# EAGLE design TriggerTrap MainBoard 0v39 Release (EAGLE 6.2)
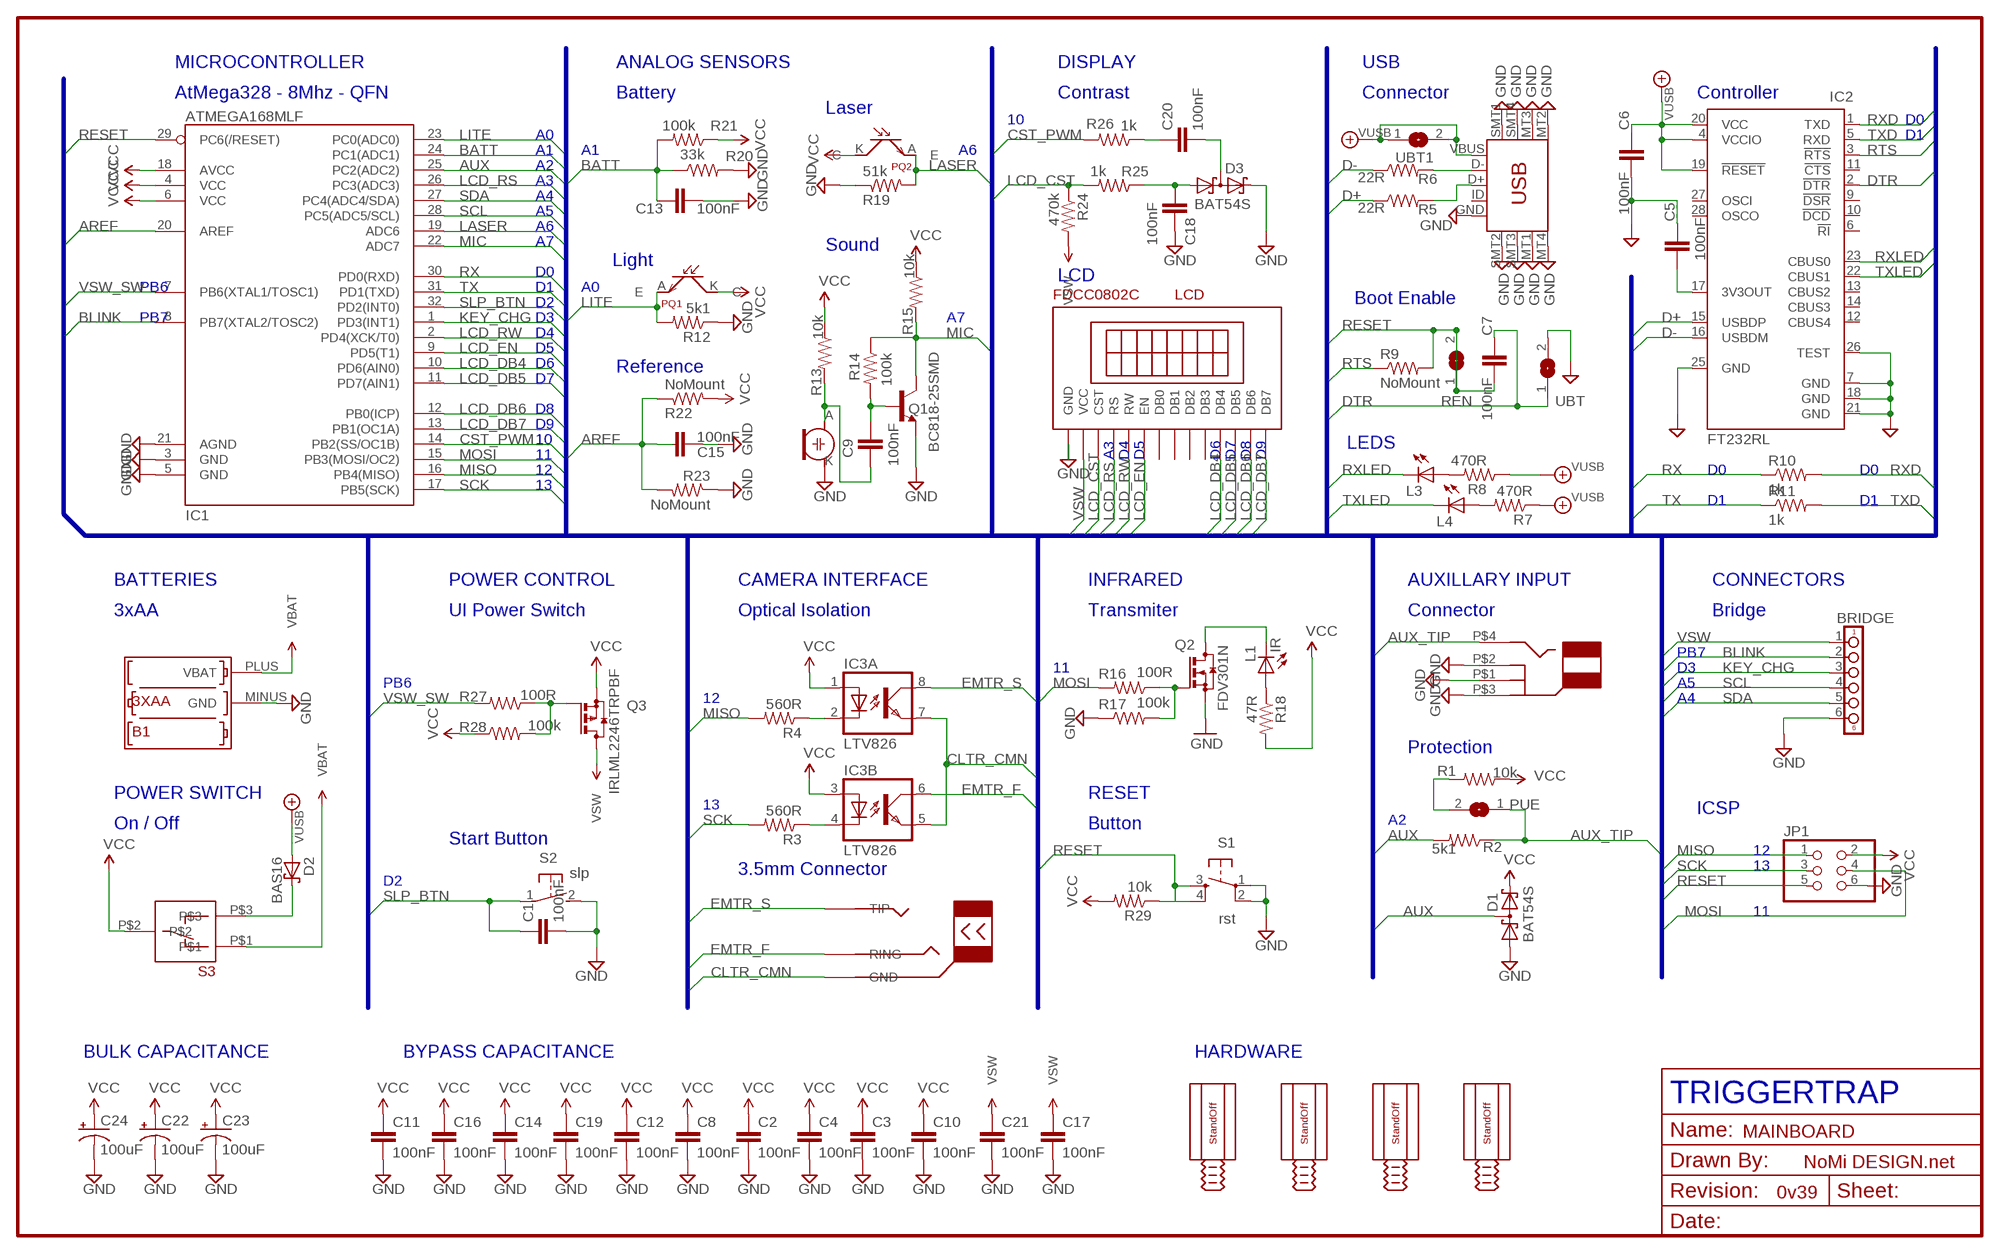
[diagram p0: schematic, sheet 1]

## Parts
AUXJACK  CUI_RCJ-017-RCA  [RCA_CUI_RCJ-017]
B1  3XAA  [3XAA-CASE]
BRIDGE  PINHD-1X6  [1X06]
C1  100nF  CAP0603-CAP  [0603-CAP]
C2  100nF  CAP0603-CAP  [0603-CAP]
C3  100nF  CAP0603-CAP  [0603-CAP]
C4  100nF  CAP0603-CAP  [0603-CAP]
C5  100nF  CAP0603-CAP  [0603-CAP]
C6  100nF  CAP0603-CAP  [0603-CAP]
C7  100nF  CAP0603-CAP  [0603-CAP]
C8  100nF  CAP0603-CAP  [0603-CAP]
C9  100nF  CAP0603-CAP  [0603-CAP]
C10  100nF  CAP0603-CAP  [0603-CAP]
C11  100nF  CAP0603-CAP  [0603-CAP]
C12  100nF  CAP0603-CAP  [0603-CAP]
C13  100nF  CAP0603-CAP  [0603-CAP]
C14  100nF  CAP0603-CAP  [0603-CAP]
C15  100nF  CAP0603-CAP  [0603-CAP]
C16  100nF  CAP0603-CAP  [0603-CAP]
C17  100nF  CAP0603-CAP  [0603-CAP]
C18  100nF  CAP0603-CAP  [0603-CAP]
C19  100nF  CAP0603-CAP  [0603-CAP]
C20  100nF  CAP0603-CAP  [0603-CAP]
C21  100nF  CAP0603-CAP  [0603-CAP]
C22  100uF  CPOL-USE2.5-7  [E2,5-7]
C23  100uF  CPOL-USE2.5-7  [E2,5-7]
C24  100uF  CPOL-USE2.5-7  [E2,5-7]
CAMJACK  AUDIO_3.5MM_L_3523  [AUDIO_3.5MM_LONG]
D1  BAT54S  [SOT23]
D2  BAS16  BAS40  [SOT23]
D3  BAT54S  [SOT23]
IC1  ATMEGA168MLF  [MLF32]
IC2  FT232RL  [SSOP28]
IC3  LTV826  [DIL08R]
JP1  PINHD-2X3/90  [2X03/90]
L1  IR  LEDSIDE_LED  [SIDE_LED]
L3  LEDCHIPLED_0805  [CHIPLED_0805]
L4  LEDCHIPLED_0805  [CHIPLED_0805]
LCD  FDCC0802C  [8X2-TOPLCD]
M1  254-ECM94-RO  MIC  [MIC-254-ECM94-RO]
PQ1  TEPT4400  AMB-LIGHT-SENS  [LED-3MM]
PQ2  EL-PT204-6C  LASER_SNS3MM  [LSR-SNS-3MM]
PUE  SJ  [SJ]
Q1  BC818-25SMD  [SOT23-BEC]
Q2  FDV301N  BSS123  [SOT23]
Q3  IRLML2246TRPBF  BSS84  [SOT23]
R1  10k  RESISTOR0603-RES  [0603-RES]
R2  5k1  RESISTOR0603-RES  [0603-RES]
R3  560R  RESISTOR0603-RES  [0603-RES]
R4  560R  RESISTOR0603-RES  [0603-RES]
R5  22R  R-US_R0603  [R0603]
R6  22R  R-US_R0603  [R0603]
R7  470R  R-US_R0603  [R0603]
R8  470R  R-US_R0603  [R0603]
R9  NoMount  R-US_R0603  [R0603]
R10  1k  R-US_R0603  [R0603]
R11  1k  R-US_R0603  [R0603]
R12  5k1  RESISTOR0603-RES  [0603-RES]
R13  10k  R-US_R0603  [R0603]
R14  100k  R-US_R0603  [R0603]
R15  10k  R-US_R0603  [R0603]
R16  100R  R-US_R0603  [R0603]
R17  100k  R-US_R0603  [R0603]
R18  47R  RESISTOR0603-RES  [0603-RES]
R19  51k  RESISTOR0603-RES  [0603-RES]
R20  33k  R-US_R0603  [R0603]
R21  100k  R-US_R0603  [R0603]
R22  NoMount  R-US_R0603  [R0603]
R23  NoMount  R-US_R0603  [R0603]
R24  470k  R-US_R0603  [R0603]
R25  1k  R-US_R0603  [R0603]
R26  1k  R-US_R0603  [R0603]
R27  100R  R-US_R0603  [R0603]
R28  100k  R-US_R0603  [R0603]
R29  10k  RESISTOR0603-RES  [0603-RES]
REN  SJ  [SJ]
S1  rst  TAC_SWITCHSMD  [TACTILE_SWITCH_SMD]
S2  slp  31-XX  [B3F-31XX]
S3  OS102011MA1QN1  SLIDESWITCH  [OS102011MA1QN1]
U$2  STAND-0FF-3.2  [STAND-OFF]
U$23  STAND-0FF-3.2  [STAND-OFF]
U$24  STAND-0FF-3.2  [STAND-OFF]
U$25  STAND-0FF-3.2  [STAND-OFF]
UBT  SJ  [SJ]
UBT1  SJ  [SJ]
USB  USB-MICRO-B-SMD  [USB-MICROB-SMD]

## Nets
AREF: C15.1 IC1.20(AREF) R22.1 R23.2
AUX: D1.3(C1A2) IC1.25(PC2(ADC2)) R2.2
AUX_TIP: AUXJACK.P$4(TIP) PUE.1 R2.1
BATT: C13.1 IC1.24(PC1(ADC1)) R20.1 R21.2
BLINK: BRIDGE.2 IC1.8(PB7(XTAL2/TOSC2))
CLTR_CMN: CAMJACK.P$1(GND) IC3.5(B:EMIT) IC3.7(A:EMIT)
CST_PWM: IC1.14(PB2(SS/OC1B)) R26.2
D+: IC2.15(USBDP) R5.1
D-: IC2.16(USBDM) R6.1
DTR: C7.1 IC2.2(!DTR) UBT.1
EMTR_F: CAMJACK.P$3(RING) IC3.6(B:COL)
EMTR_S: CAMJACK.P$2(TIP) IC3.8(A:COL)
GND: AUXJACK.P$1(GND1) AUXJACK.P$2(GND2) AUXJACK.P$3(GND) B1.MINUS(GND) BRIDGE.6 C1.2 C2.2 C3.2 C4.2 C5.1 C6.2 C8.2 C10.2 C11.2 C12.2 C13.2 C14.2 C15.2 C16.2 C17.2 C18.1 C19.2 C21.2 C22.- C23.- C24.- D1.1(A1) D3.2(C2) IC1.3(GND) IC1.5(GND) IC1.21(AGND) IC2.7(GND) IC2.18(GND) IC2.21(GND) IC2.25(GND) IC2.26(TEST) JP1.6 LCD.P$1(GND) M1.K Q1.E Q2.2(S) R12.1 R17.1 R19.1 R20.2 R23.1 S1.1 S1.2 S2.2(S) UBT.2 USB.GND USB.MT1(MTN1) USB.MT2(MTN2) USB.MT3(MTN3) USB.MT4(MTN4) USB.SMT1 USB.SMT2 USB.SMT3 USB.SMT4
KEY_CHG: BRIDGE.3 IC1.1(PD3(INT1))
LASER: IC1.19(ADC6) PQ2.A(E) R19.2
LCD_CST: LCD.P$3(CST) R24.1 R25.2
LCD_DB4: IC1.10(PD6(AIN0)) LCD.P$11(DB4)
LCD_DB5: IC1.11(PD7(AIN1)) LCD.P$12(DB5)
LCD_DB6: IC1.12(PB0(ICP)) LCD.P$13(DB6)
LCD_DB7: IC1.13(PB1(OC1A)) LCD.P$14(DB7)
LCD_EN: IC1.9(PD5(T1)) LCD.P$6(EN)
LCD_RS: IC1.26(PC3(ADC3)) LCD.P$4(RS)
LCD_RW: IC1.2(PD4(XCK/T0)) LCD.P$5(RW)
LITE: IC1.23(PC0(ADC0)) PQ1.A(E) R12.2
MIC: IC1.22(ADC7) Q1.C R14.1 R15.2
MISO: IC1.16(PB4(MISO)) JP1.1 R4.2
MOSI: IC1.15(PB3(MOSI/OC2)) JP1.4 R16.2
N$1: C9.1 M1.A R13.2
N$2: L1.K(C) Q2.3(D)
N$3: C20.1 R26.1
N$4: L1.A R18.1
N$5: C20.2 D3.3(C1A2)
N$6: D2.3(C) S3.P$3
N$7: Q2.1(G) R16.1 R17.2
N$8: L3.A R8.2
N$9: L4.A R7.2
N$10: C9.2 Q1.B R14.2
N$11: IC3.4(B:C) R3.1
N$12: Q3.1(G) R27.1 R28.2
N$13: IC3.2(A:C) R4.1
N$14: C18.2 D3.1(A1) R25.1
N$15: PUE.2 R1.2
N$17: C5.2 IC2.17(3V3OUT)
N$33: R6.2 USB.D-
N$38: R5.2 USB.D+
RESET: C7.2 IC1.29(PC6(/RESET)) JP1.5 R9.2 R29.1 REN.1 REN.2 S1.3 S1.4
RTS: IC2.3(!RTS) R9.1
RX: IC1.30(PD0(RXD)) R10.1
RXD: IC2.1(TXD) R10.2
RXLED: IC2.23(CBUS0) L3.C
SCK: IC1.17(PB5(SCK)) JP1.3 R3.2
SCL: BRIDGE.4 IC1.28(PC5(ADC5/SCL))
SDA: BRIDGE.5 IC1.27(PC4(ADC4/SDA))
SLP_BTN: C1.1 IC1.32(PD2(INT0)) S2.1(P)
TX: IC1.31(PD1(TXD)) R11.1
TXD: IC2.5(RXD) R11.2
TXLED: IC2.22(CBUS1) L4.C
VBAT: B1.PLUS(VBAT) S3.P$1
VCC: C2.1 C3.1 C4.1 C8.1 C10.1 C11.1 C12.1 C14.1 C16.1 C19.1 C22.+ C23.+ C24.+ D1.2(C2) IC1.4(VCC) IC1.6(VCC) IC1.18(AVCC) IC3.1(A:A) IC3.3(B:A) JP1.2 PQ1.K(C) PQ2.K(C) Q3.2(S) R1.1 R13.1 R15.1 R18.2 R21.1 R22.2 R28.1 R29.2 S3.P$2
VSW: BRIDGE.1 C17.1 C21.1 LCD.P$2(VCC) Q3.3(D) R24.2
VSW_SW: IC1.7(PB6(XTAL1/TOSC1)) R27.2
VUSB: C6.1 D2.1(A) IC2.4(VCCIO) IC2.19(!RESET) IC2.20(VCC) R7.1 R8.1 UBT1.1 UBT1.2 USB.VBUS
Unconnected: IC2.6(!RI) IC2.9(!DSR) IC2.10(!DCD) IC2.11(!CTS) IC2.12(CBUS4) IC2.13(CBUS2) IC2.14(CBUS3) IC2.27(OSCI) IC2.28(OSCO) LCD.P$7(DB0) LCD.P$8(DB1) LCD.P$9(DB2) LCD.P$10(DB3) USB.ID

## Buses
B$1

## Notes on the sheet
- MICROCONTROLLER | ANALOG SENSORS | DISPLAY | USB
- AtMega328 - 8Mhz - QFN | Battery | Contrast | Connector | Controller
- Laser
- 10 | D0
- A0 | D1
- A1 | A1 | A6
- A2
- A3
- A4
- A5
- A6
- A7
- Sound
- Light
- D0
- LCD
- PB6 | D1 | A0
- D2 | Boot Enable
- PB7 | D3 | A7
- D4
- D5
- D6
- Reference
- D7
- D8
- D9
- 10
- LEDS
- 11 | A3 | D4 | D5 | D6 | D7 | D8 | D9
- 12 | D0 | D0
- 13
- D1 | D1
- BATTERIES | POWER CONTROL | CAMERA INTERFACE | INFRARED | AUXILLARY INPUT | CONNECTORS
- 3xAA | UI Power Switch | Optical Isolation | Transmiter | Connector | Bridge
- PB7
- 11 | D3
- PB6 | A5
- 12 | A4
- Protection
- POWER SWITCH | RESET
- 13
- ICSP
- A2
- On / Off | Button
- Start Button
- 12
- 13
- 3.5mm Connector
- D2
- 11
- BULK CAPACITANCE | BYPASS CAPACITANCE | HARDWARE
- TRIGGERTRAP
- MAINBOARD
- NoMi DESIGN.net
- 0v39

## Library data of the parts
AUXJACK = TriggerTrap:CUI_RCJ-017-RCA
B1 = TriggerTrap:3XAA
BRIDGE = aaron_hardware:PINHD-1X6: PIN HEADER
C1-C21 = SparkFun:CAP: Capacitor Standard 0603 ceramic capacitor, and 0.1" leaded capacitor.
C22-C24 = rcl:CPOL-US: POLARIZED CAPACITOR, American symbol
CAMJACK = TriggerTrap:AUDIO_3.5MM_L_3523
D1 D3 = diode:BAT54S: Schottky Diodes Source: Fairchild .. BAT54.pdf
D2 = diode:BAS40: Silicon Schottky Diodes General-purpose diode for high-speed switching
IC1 = SparkFun:ATMEGA168
IC2 = ftdichip:FT232R: Source: http://www.ftdichip.com/Documents/DataSheets/DS_FT232R_v104.pdf
IC3 = optocoupler:LTV826: OPTO COUPLER Source: LITEON, LTV816.pdf
JP1 = pinhead:PINHD-2X3: PIN HEADER
L1 L3 L4 = led:LED: LED OSRAM: - CHIPLED LG R971, LG N971, LY N971, LG Q971, LY Q971, LO R971, LY R971 LH N974, LH R974 LS Q976, LO Q976, LY Q976 LO Q996 - Hyper CHIPLED LW Q18S LB Q993, LB Q99A, LB R99A - SideLED LS A670, LO A670, LY A670, LG A670, LP A670 LB A673, LV A673, LT A673, LW A673 LH A674 LY A675 LS A676, LA A676, LO A676, LY A676, LW A676 LS A679, LY A679, LG A679 - Hyper Micro SIDELED® LS Y876, LA Y876, LO Y876, LY Y876 LT Y87S - SmartLED LW L88C, LW L88S LB L89C, LB L89S, LG L890 LS L89K, LO L89K, LY L89K LS L896, LA L896, LO L896, LY L896 - TOPLED LS T670, LO T670, LY T670, LG T670, LP T670 LSG T670, LSP T670, LSY T670, LOP T670, LYG T670 LG T671, LOG T671, LSG T671 LB T673, LV T673, LT T673, LW T673 LH T674 LS T676, LA T676, LO T676, LY T676, LB T676, LH T676, LSB T676, LW T676 LB T67C, LV T67C, LT T67C, LS T67K, LO T67K, LY T67K, LW E67C LS E67B, LA E67B, LO E67B, LY E67B, LB E67C, LV E67C, LT E67C LW T67C LS T679, LY T679, LG T679 LS T770, LO T770, LY T770, LG T770, LP T770 LB T773, LV T773, LT T773, LW T773 LH T774 LS E675, LA E675, LY E675, LS T675 LS T776, LA T776, LO T776, LY T776, LB T776 LHGB T686 LT T68C, LB T68C - Hyper Mini TOPLED® LB M676 - Mini TOPLED Santana® LG M470 LS M47K, LO M47K, LY M47K Source: http://www.osram.convergy.de LUXEON: - LUMILED® LXK2-PW12-R00, LXK2-PW12-S00, LXK2-PW14-U00, LXK2-PW14-V00 LXK2-PM12-R00, LXK2-PM12-S00, LXK2-PM14-U00 LXK2-PE12-Q00, LXK2-PE12-R00, LXK2-PE12-S00, LXK2-PE14-T00, LXK2-PE14-U00 LXK2-PB12-K00, LXK2-PB12-L00, LXK2-PB12-M00, LXK2-PB14-N00, LXK2-PB14-P00, LXK2-PB14-Q00 LXK2-PR12-L00, LXK2-PR12-M00, LXK2-PR14-Q00, LXK2-PR14-R00 LXK2-PD12-Q00, LXK2-PD12-R00, LXK2-PD12-S00 LXK2-PH12-R00, LXK2-PH12-S00 LXK2-PL12-P00, LXK2-PL12-Q00, LXK2-PL12-R00 Source: www.luxeon.com KINGBRIGHT: KA-3528ASYC Source: www.kingbright.com
LCD = TriggerTrap:FDCC0802C
M1 = TriggerTrap:MIC
PQ1 = TriggerTrap:AMB-LIGHT-SENS
PQ2 = TriggerTrap:LASER_SNS
PUE REN UBT UBT1 = jumper:SJ: SMD solder JUMPER
Q1 = transistor-npn:BC818*: NPN Transistor
Q2 = transistor-small-signal:BSS123: N-CHANNEL MOS FET
Q3 = transistor-small-signal:BSS84: P-CHANNEL MOS FET
R1-R4 R12 R18 R19 R29 = SparkFun:RESISTOR: Resistor Basic schematic elements and footprints for 0603, 1206, and PTH resistors.
R5-R11 R13-R17 R20-R28 = rcl:R-US_: RESISTOR, American symbol
S1 = SparkFun:TAC_SWITCH: Momentary Switch Button commonly used for reset or general input. Spark Fun Electronics SKU : COM-00097
S2 = switch-omron:31-XX: OMRON SWITCH
S3 = TriggerTrap:SLIDESWITCH
U$2 U$23-U$25 = TriggerTrap:STAND-0FF-3.2
USB = TriggerTrap:USB-MICRO-B-SMD

## Net classes
0 default: width 0.152 mm, drill 0.3 mm, clearance 0.152 mm
1 power: width 0.254 mm, drill 0.3 mm, clearance 0.152 mm

## Board
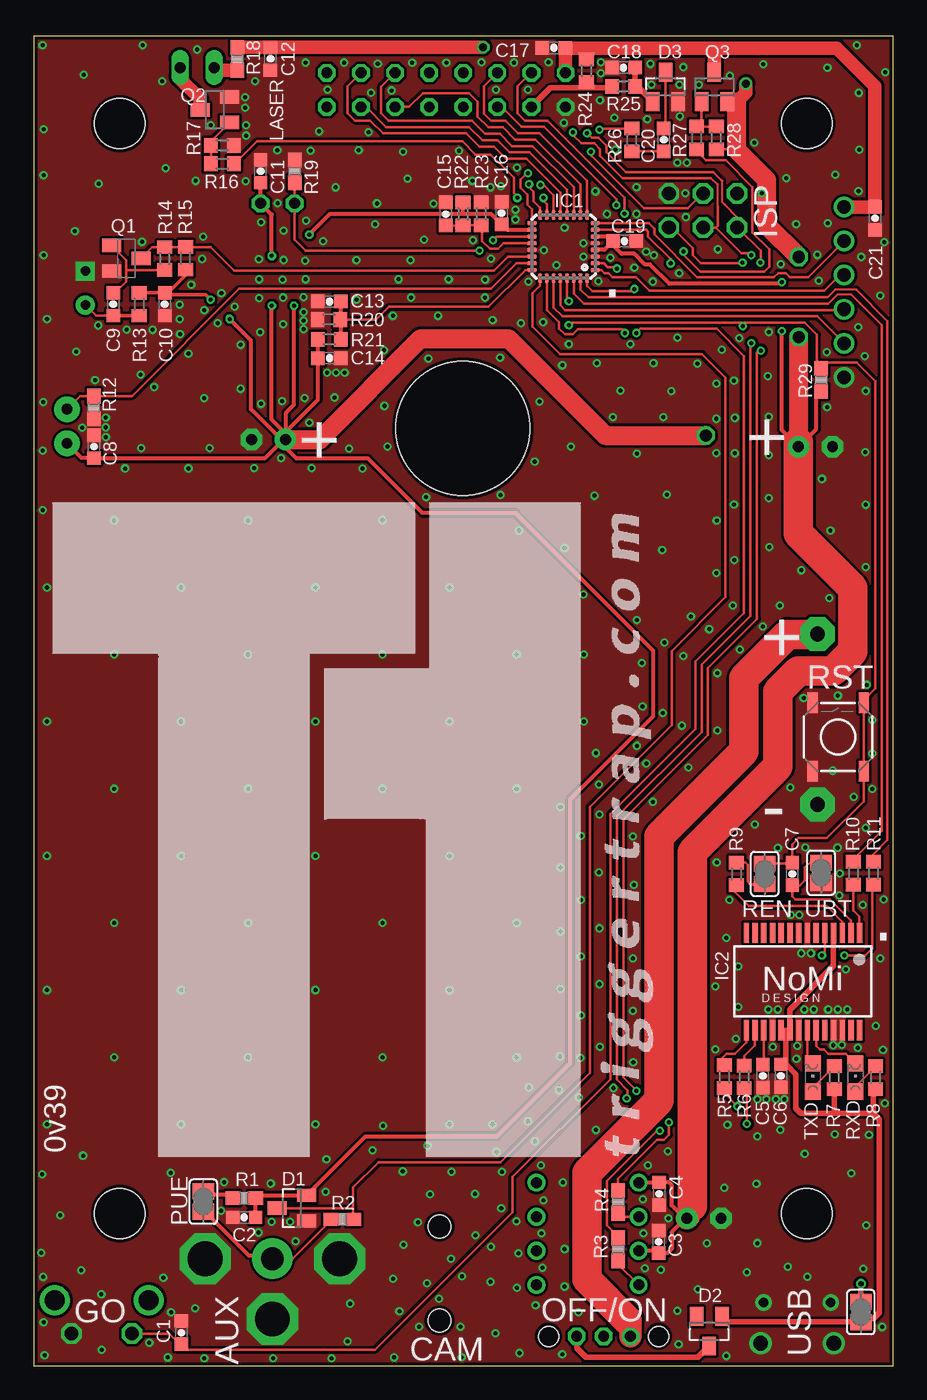
[diagram p1: board, top side]
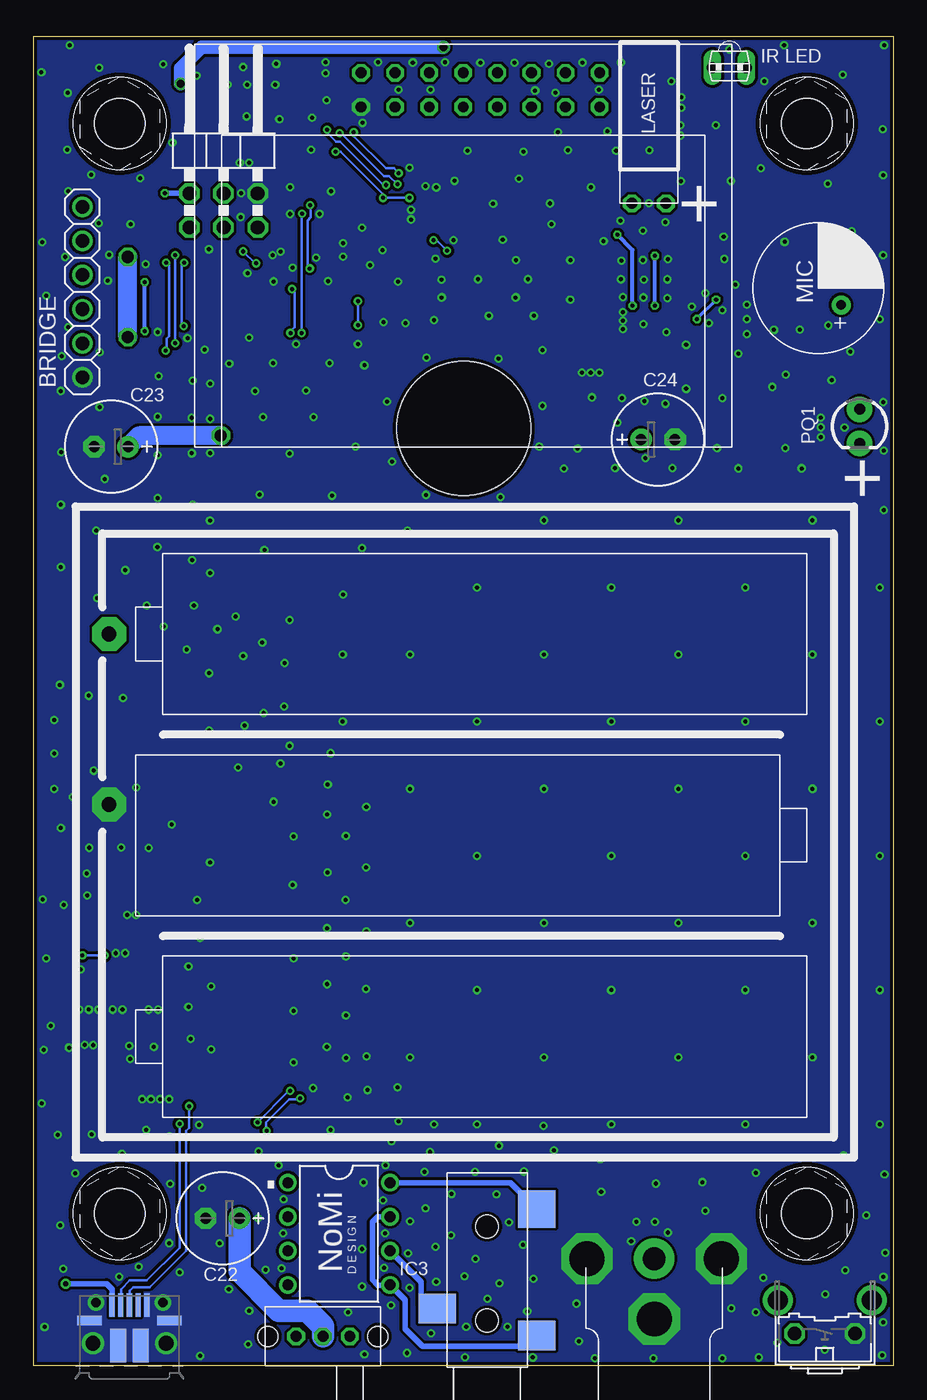
[diagram p2: board, bottom side, seen from below]

Size 64.04 x 99.05 mm. Coordinates in mm from the lower left corner, seen from the top.
Outline: 64.04,0 64.04,99.05 0,99.05 0,0 64.04,0
Copper layers (1*16): Top 0.035mm / dielectric 1.5mm / Bottom 0.035mm
Design rules: minimum track width 6mil, minimum drill 0.3mm, track to track 8mil, track to pad 6mil, pad to pad 6mil, via to via 8mil, smd to smd 0mil, copper to edge 10mil, drill to drill 10mil, minimum pad ring 10mil, minimum via ring 6mil, stop-mask expansion 2mil, vias tented up to drill 100mil, thermal gap 10mil
Holes 10 mm at 31.99,69.85

### Footprints (pad centres in the part's own frame; a part is rotated, then mirrored left to right if it is on the bottom)
RCA_CUI_RCJ-017 = drill 2.6 pad 3.81 octagon: P$1 0,0; P$2 -5,-4.5; P$3 5,-4.5 | drill 1.7 pad 3: P$4 0,-4.5
3XAA-CASE = drill 1.1 pad 2.54 octagon: MINUS 0,12.7; PLUS 0,0
1X06 = drill 1.016: 1 -6.35,0; 2 -3.81,0; 3 -1.27,0; 4 1.27,0; 5 3.81,0; 6 6.35,0
0603-CAP = smd 1 x 1: 1 -0.85,0; 2 0.85,0
E2,5-7 = drill 0.813 pad 1.6: + -1.27,0 | drill 0.813 pad 1.6 octagon: - 1.27,0
AUDIO_3.5MM_LONG = smd 2.2 x 2.8: P$1 -4.6,-3.7; P$3 -2.6,3.7 | smd 2.8 x 2.8: P$2 4.8,-3.7 | hole 1.7: -3.5,0; 3.5,0
SOT23 = smd 1 x 1.4: 1 -0.95,-1.1; 2 0.95,-1.1; 3 0,1.1
MLF32 = smd 0.7 x 0.3: 1 -2.35,1.75; 2 -2.35,1.25; 3 -2.35,0.75; 4 -2.35,0.25; 5 -2.35,-0.25; 6 -2.35,-0.75; 7 -2.35,-1.25; 8 -2.35,-1.75; 17 2.35,-1.75; 18 2.35,-1.25; 19 2.35,-0.75; 20 2.35,-0.25; 21 2.35,0.25; 22 2.35,0.75; 23 2.35,1.25; 24 2.35,1.75 | smd 0.3 x 0.7: 9 -1.75,-2.35; 10 -1.25,-2.35; 11 -0.75,-2.35; 12 -0.25,-2.35; 13 0.25,-2.35; 14 0.75,-2.35; 15 1.25,-2.35; 16 1.75,-2.35; 25 1.75,2.35; 26 1.25,2.35; 27 0.75,2.35; 28 0.25,2.35; 29 -0.25,2.35; 30 -0.75,2.35; 31 -1.25,2.35; 32 -1.75,2.35
SSOP28 = smd 0.4 x 1.5: 1 -4.225,-3.625; 2 -3.575,-3.625; 3 -2.925,-3.625; 4 -2.275,-3.625; 5 -1.625,-3.625; 6 -0.975,-3.625; 7 -0.325,-3.625; 8 0.325,-3.625; 9 0.975,-3.625; 10 1.625,-3.625; 11 2.275,-3.625; 12 2.925,-3.625; 13 3.575,-3.625; 14 4.225,-3.625; 15 4.225,3.625; 16 3.575,3.625; 17 2.925,3.625; 18 2.275,3.625; 19 1.625,3.625; 20 0.975,3.625; 21 0.325,3.625; 22 -0.325,3.625; 23 -0.975,3.625; 24 -1.625,3.625; 25 -2.275,3.625; 26 -2.925,3.625; 27 -3.575,3.625; 28 -4.225,3.625
DIL08R = drill 0.813: 1 -3.81,-3.81; 2 -1.27,-3.81; 3 1.27,-3.81; 4 3.81,-3.81; 5 3.81,3.81; 6 1.27,3.81; 7 -1.27,3.81; 8 -3.81,3.81
2X03/90 = drill 1.016 octagon: 1 -2.54,-6.35; 2 -2.54,-3.81; 3 0,-6.35; 4 0,-3.81; 5 2.54,-6.35; 6 2.54,-3.81
SIDE_LED = drill 0.813 long: A 1.27,0; K -1.27,0
CHIPLED_0805 = smd 1.2 x 1.2: A 0,-1.05; C 0,1.05
8X2-TOPLCD = drill 0.8 octagon: P$1 -7.62,-1.27; P$2 -7.62,1.27; P$3 -5.08,-1.27; P$4 -5.08,1.27; P$5 -2.54,-1.27; P$6 -2.54,1.27; P$7 0,-1.27; P$8 0,1.27; P$9 2.54,-1.27; P$10 2.54,1.27; P$11 5.08,-1.27; P$12 5.08,1.27; P$13 7.62,-1.27; P$14 7.62,1.27; P$15 10.16,-1.27; P$16 10.16,1.27
MIC-254-ECM94-RO = drill 0.7 pad 1.422: A 1.27,-1.7 | drill 0.7 pad 1.422 square: K -1.27,-1.7
LED-3MM = drill 0.813 pad 1.88: A -1.27,0; K 1.27,0
LSR-SNS-3MM = drill 0.813 octagon: A -1.27,-7.62; K 1.27,-7.62
SJ = smd 1.168 x 1.6: 1 -0.762,0; 2 0.762,0
SOT23-BEC = smd 1 x 1.4: B -0.95,-1.1; C 0,1.1; E 0.95,-1.1
0603-RES = smd 1.1 x 1: 1 -0.85,0; 2 0.85,0
R0603 = smd 1 x 1.1: 1 -0.85,0; 2 0.85,0
TACTILE_SWITCH_SMD = smd 1.524 x 0.762: 1 -2.54,1.905; 2 2.54,1.905; 3 -2.54,-1.905; 4 2.54,-1.905
B3F-31XX = drill 1.016 octagon: 1 -2.261,-1.245; 2 2.261,-1.245 | drill 1.499 pad 2.159: 3 -3.505,1.245; 4 3.505,1.245
OS102011MA1QN1 = drill 0.8 octagon: P$1 -2,0; P$2 0,0; P$3 2,0 | hole 1.5: 4.1,0; -4.1,0
STAND-OFF = hole 3.75: 0,0
USB-MICROB-SMD = smd 0.4 x 1.75: D+ 0,2.54; D- -0.65,2.54; GND 1.3,2.54; ID 0.65,2.54; VBUS -1.3,2.54 | drill 0.7: MT1 -2.5,2.745; MT4 2.5,2.745 | drill 1.1: MT2 -2.725,-0.285; MT3 2.725,-0.285 | smd 1.825 x 0.7: SMT1 -2.987,1.415; SMT2 2.987,1.415 | smd 1.175 x 2.5: SMT3 -0.838,-0.448; SMT4 0.838,-0.448

### Placement (x,y rotation side)
AUXJACK  17.8,3.49 180 bottom
B1  58.42,54.53 180 bottom
BRIDGE  60.4,80 270 bottom
C1  11.02,2.49 90 top
C2  15.7,11.07 180 top
C3  46.58,9.25 90 top
C4  46.61,12.83 270 top
C5  54.34,21.6 90 top
C6  55.68,21.62 270 top
C7  56.54,36.65 90 top
C8  4.5,68.49 90 top
C9  5.94,79.1 90 top
C10  9.78,79.1 270 top
C11  16.92,89 90 top
C12  17.65,97.38 270 top
C13  22.05,79.3 180 top
C14  22.04,75.08 0 top
C15  30.72,85.82 90 top
C16  34.88,85.88 90 top
C17  38.76,98.2 180 top
C18  43.97,96.72 0 top
C19  44.04,83.81 0 top
C20  46.96,91.34 90 top
C21  62.7,85.5 270 top
C22  49.96,11 180 bottom
C23  58.26,68.48 180 bottom
C24  17.51,69.02 0 bottom
CAMJACK  30.25,6.88 90 bottom
D1  19.25,11.76 90 top
D2  50.34,2.59 180 top
D3  47.09,95.28 0 top
IC1  39.5,83.39 180 top
IC2  57.33,28.64 180 top
IC3  41.29,9.85 270 bottom
JP1  49.88,91.17 0 bottom
L1  12.19,96.73 180 bottom
L3  61.24,21.49 0 top
L4  58.06,21.49 0 top
LCD  32.02,95.07 0 bottom
M1  5.56,80.3 270 top
PQ1  2.49,70 270 bottom
PQ2  18.19,94.23 0 bottom
PUE  12.65,12.24 90 top
Q1  6.91,82.51 270 top
Q2  13.51,93.58 90 top
Q3  50.72,95.28 0 top
R1  15.7,12.52 180 top
R2  23.01,10.92 0 top
R3  43.56,8.69 90 top
R4  43.56,12.22 90 top
R5  51.48,21.55 270 top
R6  52.95,21.53 270 top
R7  59.66,21.49 90 top
R8  62.74,21.49 90 top
R9  52.37,36.65 90 top
R10  61.09,36.7 270 top
R11  62.59,36.7 270 top
R12  4.49,71.41 90 top
R13  7.87,79.1 270 top
R14  9.78,82.5 270 top
R15  11.33,82.52 90 top
R16  14.07,89.56 0 top
R17  14.07,90.93 180 top
R18  15.2,97.37 90 top
R19  19.46,89 270 top
R20  22.02,77.96 180 top
R21  22.04,76.48 0 top
R22  32,85.83 90 top
R23  33.37,85.83 270 top
R24  41.2,96.49 90 top
R25  43.97,95.33 180 top
R26  44.58,91.34 90 top
R27  49.4,91.49 270 top
R28  50.88,91.49 90 top
R29  58.69,73.46 270 top
REN  54.48,36.66 270 top
S1  59.95,46.86 90 top
S2  5.08,3.65 0 bottom
S3  42.48,2.2 0 bottom
U$2  6.42,11.35 0 bottom
U$23  57.62,11.35 0 bottom
U$24  57.62,92.56 0 bottom
U$25  6.42,92.56 0 bottom
UBT  58.68,36.74 270 top
UBT1  61.65,4.01 90 top
USB  56.9,1.98 0 bottom

### Tracks (layer width: path | path; a pad name or v marks a point on that pad's centre or on a via)
AREF
  Top 0.203: IC1.20 35,83.64 34.59,83.24 34,83.24 33.42,83.81 33.42,84.83 R23.2 R22.1 31.97,84.95 30.74,84.95 C15.1
AUX
  Top 0.203: 37.71,81.01 IC1.25 37.75,80.5 37.19,79.93 37.19,77.42 39.22,75.39 49.8,75.39 51.56,73.63 51.56,57.28 47.55,53.26 47.55,47.75 41.45,41.66 41.45,21.82 34.81,15.18 25.69,15.18 23.82,13.31 23.82,11.86 | 23.82,11.86 23.82,10.96 R2.2 | D1.3 23.72,11.76 23.82,11.86
AUX_TIP
  Top 0.203: AUXJACK.P$4 19.32,7.99 22.02,10.69 22.02,10.78 R2.1
  Top 0.305: PUE.1 12.78,11.48 16.03,8.23 17.56,8.23 AUXJACK.P$4
BATT
  Top 0.203: IC1.24 36.64,81.64 33.91,78.92 26.49,78.92 25.53,77.96 R20.1
  Top 0.305: C13.1 22.9,77.99 R20.1 22.89,77.93 R21.2
BLINK
  Top 0.203: IC1.8 45.85,85.14 46.25,84.74 46.25,84.3 49.44,81.11 55.18,81.11 55.49,81.42 56.07,81.42 56.36,81.13 57.72,81.13 BRIDGE.2
CLTR_CMN
  Bottom 0.406: IC3.7 38.41,11.12 38.79,10.73 38.79,6.4 38.41,6.02 37.48,6.02 IC3.5 36.37,4.93 36.37,2.78 35.06,1.47 27.36,1.47 CAMJACK.P$1
CST_PWM  (via drill 0.3)
  Top 0.203: IC1.14 38.75,87.23 38,87.99 v37.77,87.99 | R26.2 42.25,92.19 v42.16,92.1
  Bottom 0.203: v37.77,87.99 37.92,87.99 37.95,88.01 38,88.01 41.2,91.21 41.5,91.21 42.16,91.87 v42.16,92.1
D+
  Top 0.203: IC2.15 53.11,24.1 52.25,23.24 51.62,23.24 51.38,23.01 51.38,22.41 51.37,22.4 R5.1
D-
  Top 0.203: IC2.16 53.76,23.88 52.97,23.09 52.97,22.57 52.85,22.45 R6.1
DTR
  Top 0.203: C7.1 56.54,34.99 56.78,34.75 59.34,34.75 60.91,33.18 IC2.2 | C7.1 56.54,35.85 | C7.1 56.66,35.85 | C7.1 56.55,35.8 C7.1 | UBT.1 58.59,37.59 57.94,37.59 57.48,37.13 57.48,36.17 57.11,35.8 C7.1
  Top 0.254: UBT.1 58.57,37.61
EMTR_F
  Bottom 0.406: IC3.6 35.15,6.25 35.15,4.5 34.94,4.28 CAMJACK.P$3
EMTR_S
  Bottom 0.406: IC3.8 28.52,13.66 CAMJACK.P$2
GND  (via drill 0.3)
  other vias: 55.95,19.88 57.93,30.75 57.22,30.75 55.47,26.55 54.76,26.55 57.42,26.55 58.13,26.55 59.2,26.55 59.92,26.55 60.63,26.55 59.6,23.9 61.8,34.34 56.9,23.85 56.41,33.61 57.07,33.61 60.04,35.07 59.91,38.61 60.23,23.91 55.3,19.88 54.6,19.88 52.5,29.76 52.5,26.76 56.85,22.88 55.08,23.77 45.56,7.27 45.46,9.87 45.41,12.43 45.79,14.94 53.93,19.88 61.4,23.71 15.77,93.73 15.85,92.43 15.77,94.51 62.77,25.34 63.43,19.55 50.8,23.59 8.63,1.73 0.82,0.79 51.85,34.71 51.62,31.9 50.88,70.56 59.39,62.23 62,59.51 54.79,77.03 50.9,62.99 57.2,59.28 59.28,57.22 55.6,56.64 50.95,51.61 54.36,55.09 50.88,59.08 52.1,56.66 50.95,47.34 48.79,44.57 46.15,42.03 44.66,39.45 44.72,35.84 44.65,30.38 44.65,26.44 44.68,22.63 41.91,17.57 37.82,14.93 38,12.34 37.85,9.88 39.57,5.92 37.92,7.31 37.41,4.52 39.4,0.86 31.93,6.68 32.94,9.72 34.04,6.27 29.31,6.17 30.23,5 31.9,0.66 31.11,7.97 27.56,9.01 34.85,11.73 37.36,16.74 40.64,20.01 43.21,20.7 40.61,3.98 36.22,0.96 47.27,16 53.92,17.1 51.71,17.95 53.93,9.15 48.07,1.61 59.7,17.24 57.45,15.8 55.65,17.58 63.3,23.55 60.93,14.35 53.87,13.56 60.53,29.54 63.09,30.35 63.35,34.74 60.07,36.7 62,40.07 55.47,38.6 57.51,38.63 50.9,37.51 52.32,24.36 50.8,28.27 53.75,40.33 57.38,49.76 59.56,44.35 62.08,50.75 42.19,23.77 42.16,28.44 42.16,32.61 42.14,36.78 42.16,41.09 45.65,44.88 48.31,47.7 48.41,52.88 49,55.83 47.19,64.92 27.25,4.09 26.8,6.5 26.85,0.63 23.39,1.85 17.68,13.59 5.08,1.22 10.01,0.63 12.73,0.58 17.86,0.58 22.2,0.58 23.6,4.64 31.8,2.92 28.73,2.92 0.74,3.26 28.63,10.7 32.9,12.81 29.55,12.78 34.91,14.46 36.84,18.22 39.15,20.55 40.75,22.94 40.77,26.12 40.77,30.51 40.8,34.73 40.77,39.48 42.12,43.31 44.96,46.2 46.89,48.65 47,53.9 46.84,60.79 31.15,14.46 27.51,14.48 34.19,17.99 36.91,20.76 39.22,23.07 39.27,28.1 39.25,32.37 39.27,37.14 39.25,41.64 41.92,45.65 45.39,49.13 45.34,52.38 44.96,55.58 40.04,68.48 0.71,6.63 5.05,5.33 9.68,6.58 3.56,7.13 0.58,8.43 0.64,14.27 1.98,11.22 34.82,87.9 36.02,89.28 23.19,74.01 22.53,74.01 21.87,74.01 20.12,78.51 20.12,77.87 20.12,77.24 38.03,83.14 40.97,82.66 40.97,83.65 39.58,84.81 38.97,82 3.08,84.53 10.91,76.86 4.81,77.52 34.04,87.8 3.61,69.92 0.69,63.77 5.38,69.93 5.39,70.65 5.39,69.21 20.63,90.54 18.19,86.63 18.17,90.57 0.74,82.74 8.12,98.41 0.77,92.14 0.67,98.39 13.19,92.42 0.74,88.71 4.86,88.08 23.5,68.34 0.72,71.8 1,18 1,28 1,38 1,48 1,58 0.7,68.2 1,78 6,23 11,18 11,28 16,23 21,18 31,18 26,23 21,28 36,23 31,28 36,33 26,33 16,33 6,33 11,38 6,43 21,38 31,38 36,43 26,43 16,43 11,48 6,53 21,48 16,53 11,58 6,63 31,48 26,53 21,58 16,63 4.58,73.46 41,48 36,53 31,58 26,63 36.18,62.24 40.97,57.47 41,53 56.22,7.37 62.26,17.22 10.21,14.4 3.68,15.67 62.51,48.13 62.51,45.62 62.51,42.97 50.88,68.02 35.92,86.13 35.92,85.41 45.65,83.01 46.23,82.75 42.98,82.58 41.88,87.5 44.93,85.83 44.75,81.81 46.15,80.8 42.09,80.82 48.62,85.6 51.28,75.71 44.48,76.12 39.88,76.12 24.97,91.92 21.28,91.97 20.27,97.1 21.92,95.07 61.35,98.4 48.13,95.45 42.27,97.13 43.29,92.99 38.38,97.13 36.84,95.07 42.22,94.31 46.03,95.45 48.42,96.77 45.95,97 23.14,97.1 25.65,97.03 25.14,94.84 26.67,95.02 28.22,97.08 30.76,97.08 33.37,97.13 34.46,95.07 35.79,97.1 61.5,94.84 54.39,96.97 63.45,96.39 63.4,83.72 63.1,79.73 61.68,82.62 54.79,70.71 54.71,73.73 54.79,67.87 54.79,64.67 54.81,61.01 52.63,53.39 50.34,54.89 58.75,66.09 62,64.16 61.98,68.07 59.13,71.42 62.03,72.64 52.2,73.4 52.27,70.63 52.25,67.99 52.2,64.18 52.22,60.04 50.88,73.17 46.2,74.7 43.18,70.69 46.94,70.69 41.99,74.72 39.4,74.55 34.77,75.13 36.88,80.79 36.32,77.7 34.21,77.92 49.45,74.67 29.41,75.05 55.68,82.1 48.57,87.38 42.72,85.83 32.69,88.28 29.79,86.58 37.97,77.77 26.14,71.53 26.37,68.48 34.8,64.9 37.69,71.83 37.34,67.37 44.96,67.98 18.45,67.63 24.52,66.84 6.81,66.87 8.03,68.37 13.11,68.37 9,72.94 13.72,77.69 11.54,75.43 12.71,72.1 20.55,70.28 22.43,72.16 20.19,72.11 26.11,75.69 26.77,78.23 30.12,78.23 33.63,79.6 33.66,80.92 34.09,82.5 28.12,79.6 30.94,80.95 28.09,82.37 29.08,83.9 27.2,80.95 24.05,82.37 24.05,79.43 20.27,80.95 16.81,80.95 16.81,79.55 14.99,78.92 12.62,84.12 8.08,83.74 12.57,82.47 14,79.93 12.73,78.66 8.86,77.19 6.93,77.22 7.98,73.86 10.9,77.98 10.9,79.07 3.17,75.56 20.32,85.32 31.7,90.55 24.23,90.57 25.58,86.61 25.45,85.06 21.56,83.79 16.97,85.21 27.86,88.44 27.53,90.47 22.5,87.8 12.09,88.28 39.58,60.94 41.79,64.83 11.54,66.87 16.44,66.89 20.71,66.89 56.82,85.07 18.59,77.62 18.52,71.88 16.97,71.68 16.89,77.01 15.42,72.8 15.42,76.07 45.73,92.88 25.25,16.06 29.37,16.41 34.5,15.93 26.05,17.9 34.42,2.44 39.57,8.71 32.74,83.87 18.64,84.58 20.12,79.63 18.59,79.6 43.74,72.67 47.52,72.62 19.13,10.74 17.73,10.72 19.51,9.28 14.2,13.7 16.77,9.94 13.97,11.56 21.75,12.98 12.04,4.29 21.82,15.39 11.76,80.54 43.36,90.6 59.94,49.93 56.39,43.1 61.11,42.39 48.11,81.41 47.99,89.63 48.67,89.63 50.98,83.19 44.94,87.81 34.09,8.89 35.99,10.77 39.45,13.66 57.66,6.64 61.83,7.25 62.06,10.47 63.23,2.9 51.62,0.74 46.75,7.17 47.97,4.12 53.15,6.97 50.18,9.13 51.49,13.28 47.31,11.01 9.84,89.25 15.81,88.26 9.59,95.71 15.85,91.67 16.51,95.71 12.18,98.08 49.49,5.72 61.47,77.39 61.95,75.23 52.58,76.58 47.98,76.61 29.26,64.74 3.74,96.21 51.9,96.14 59.16,96.72 53.7,91.13 56.09,88.49 61.47,87.53 61.52,90.6 59.19,85.14 59.75,88.74 58.5,80.84 58.4,82.78 59.11,75.54 20.24,82.35 16.79,82.45 18.64,82.4 39.53,92.61 49.58,95.45 48.16,93.09 42.27,96.31 18.57,80.92 36.02,5.81 36.14,8.4 10.24,4.01
  pour Top (isolate 0.203, no thermals): 0,99.06 64.01,99.03 64.06,0 35.63,0.06 0,0
  pour Bottom (isolate 0.203, no thermals): 0,99.06 64.01,99.06 64.06,0.02 26.13,0 0.01,-0.01
KEY_CHG
  Top 0.203: IC1.1 42.31,81.64 42.55,81.41 42.82,81.41 43.13,81.1 44.88,81.1 45.87,80.11 58.93,80.11 60.02,81.2 60.34,81.2 BRIDGE.3
LASER  (via drill 0.3)
  Top 0.203: IC1.19 34.51,84.14 v34.24,83.87 | R19.2 PQ2.A 19.46,83.9 20.27,83.08 v33.22,83.08
  Bottom 0.203: v34.24,83.87 34.01,83.87 v33.22,83.08
LCD_CST
  Top 0.203: LCD.P$3
  Top 0.406: LCD.P$3 38.53,95.22 41.33,95.22 | 41.33,95.22 R24.1 | 41.33,95.22 43.02,95.22 R25.2
LCD_DB4
  Top 0.203: IC1.10 40.75,88.03 37.41,91.36 35.89,91.36 34.98,92.28 33.88,92.28 33.1,93.07 33.1,94.18 32.46,94.82 29.01,94.82 27.99,93.8 LCD.P$11
LCD_DB5
  Top 0.203: IC1.11 40.25,87.82 37.19,90.88 35.66,90.88 34.75,91.8 33.66,91.8 32.66,92.79 26.47,92.79 25.91,93.34 25.91,95.31 LCD.P$12
LCD_DB6
  Top 0.203: IC1.12 39.75,87.63 36.96,90.42 35.46,90.42 34.57,91.31 33.45,91.31 32.46,92.3 26.26,92.3 24.77,93.8 LCD.P$13
LCD_DB7
  Top 0.203: IC1.13 39.25,87.42 36.73,89.94 35.2,89.94 34.31,90.83 33.22,90.83 32.23,91.82 26.04,91.82 25.07,92.79 23.95,92.79 23.39,93.34 23.39,95.33 LCD.P$14
LCD_EN
  Top 0.203: IC1.9 41.25,88.29 37.69,91.85 36.09,91.85 35.18,92.76 34.09,92.76 33.55,93.29 33.55,95.33 LCD.P$6
LCD_RS  (via drill 0.3)
  Top 0.203: LCD.P$4 37.06,96.34 36.04,95.33 36.04,93.34 36.6,92.79 38.3,92.79 44.04,87.05 v44.04,85.85 | v44.07,76.96 44.07,77.01 43.84,77.24 40.56,77.24 40.18,76.86 39.6,76.86 39.17,77.29 39.17,77.75 38.25,78.66 IC1.26
  Bottom 0.203: 44.07,85.85 v44.04,85.85 | 44.07,85.85 44.09,85.83 | v44.07,76.96 44.07,85.85
LCD_RW  (via drill 0.3)
  Top 0.203: LCD.P$5 34.87,93.8 36.35,92.33 38.02,92.33 43.43,86.92 v43.43,86.49 | IC1.2 42.49,82.14 42.77,81.86 43.43,81.86 v43.46,81.76
  Bottom 0.203: v43.43,86.49 43.43,86.44 43.38,86.39 43.38,85.57 43.64,85.32 43.64,82.02 v43.46,81.76
LITE
  Top 0.203: IC1.23 35.97,82.14 34.07,80.25 15.33,80.25 7.34,72.26 R12.2 3.48,72.26 PQ1.A
MIC
  Top 0.203: IC1.22 35.35,82.64 34.31,81.61 14.94,81.61 13.18,83.36 11.32,83.36 | 11.32,83.36 11.18,83.36 11.16,83.35 R14.1 8.85,83.35 Q1.C | 11.32,83.36 R15.2
MISO  (via drill 0.3)
  Top 0.152: 51.51,86.51 51.33,86.69 51.33,88.29 51.31,88.32
  Top 0.203: v54.2,75.64 54.25,75.62 54.23,75.67 v54.2,75.64 | v44.93,20.5 44.98,20.47 43.97,21.49 43.97,40.72 50.24,46.99 50.24,51.99 53.9,55.65 53.9,75.49 54.2,75.79 v54.2,75.64 | IC1.16 37.75,86.28 37.26,86.77 37.26,87.48 36.88,87.86 v36.93,88.04 | v41.25,91.85 41.6,91.49 42.09,91.49 42.67,90.91 42.67,90.41 44.13,88.95 50.67,88.95 51.31,88.32 | R4.2 43.56,13.95 46.46,16.84 46.97,16.84 47.35,17.22 v47.35,18.16 | v54.15,82.19 54.18,82.22 54.18,83.08 52.44,84.82 JP1.1 52.42,85.6 51.51,86.51
  Bottom 0.203: v44.93,20.5 45.06,20.5 45.06,20.45 v47.35,18.16 | v36.93,88.04 37.54,88.65 37.92,88.65 41.12,91.85 v41.25,91.85 | v54.2,75.64 54.15,75.69 54.13,75.69 54.13,76.53 53.95,76.71 53.95,81.99 v54.15,82.19
MOSI  (via drill 0.3)
  Top 0.203: IC1.15 38.25,86.54 37.9,86.89 37.9,86.92 v38,87.02 | v36.04,87.02 35.99,87.07 35.99,87.17 35.79,87.38 35.79,88.52 35.08,89.23 34.06,90.25 32.94,90.25 31.95,91.24 16.66,91.24 14.83,89.41 14.83,89.47 R16.2 | v41.53,90.45 41.53,90.22 41.6,90.14 45.48,86.25 48.77,86.24 JP1.4
  Bottom 0.203: v36.04,87.02 v38,87.02 38,87.3 41.15,90.45 v41.53,90.45
N$1
  Top 0.203: C9.1 4.65,78.25 M1.A
  Top 0.254: C9.1 R13.2
N$2
  Top 1.016: Q2.3 12.41,94.39 10.82,95.99 10.82,96.63 L1.K
N$3
  Top 0.203: R26.1 C20.1
N$4
  Top 1.016: R18.1 13.67,96.52 L1.A
N$5
  Top 0.203: D3.3 47.09,92.31 C20.2
N$6
  Top 0.406: S3.P$3 40.48,1.3 41.15,0.64 49.49,0.64 D2.3
N$7
  Top 0.203: 14.62,92.62 Q2.1 13.22,91.24 R17.2 R16.1
N$8
  Top 0.203: R8.2 62.74,22.28 61.24,20.78 L3.A
N$9
  Top 0.203: R7.2 59.66,22.33 58.17,20.83 58.17,20.54 L4.A
N$10
  Top 0.203: C9.2 6.06,79.95 6.91,80.8 6.91,81.64 | 6.91,81.64 6.91,82.37 Q1.B | R14.2 6.92,81.65 6.91,81.64
N$11
  Top 0.203: IC3.4 43.56,7.57 R3.1
N$12
  Top 0.203: R27.1 49.66,92.34 49.77,92.34 | 49.77,92.34 Q3.1 | 49.77,92.34 R28.2
N$13
  Top 0.203: IC3.2 43.81,11.12 R4.1
N$14
  Top 0.406: D3.1 44.99,95.33 R25.1 C18.2 | C18.2 44.82,96.92 44.78,96.95 44.78,96.76 C18.2
N$15
  Top 0.305: R1.2 14.78,12.52 14.53,12.78 12.88,12.78 PUE.2
N$17
  Top 0.203: IC2.17 54.41,22.69 C5.2
N$33  (via drill 0.3)
  Top 0.203: R6.2 52.95,20.66 53.16,20.45 v53.16,18.03
  Bottom 0.203: v53.16,18.03 53.16,8.81 55.6,6.38 56.87,6.38 57.53,5.71 57.53,4.54 USB.D-
N$38  (via drill 0.3)
  Top 0.203: R5.2 51.48,20.33 v52.45,19.36
  Bottom 0.203: v52.45,19.36 52.45,17.75 52.68,17.53 52.68,8.59 55.4,5.87 56.62,5.87 56.9,5.59 USB.D+
RESET  (via drill 0.3)
  Top 0.203: R9.2 53.05,37.5 53.21,37.34 53.21,36.09 53.42,35.89 REN.2 REN.1 56.33,37.42 56.42,37.5 C7.2 56.54,38.86 57,39.32 59.11,39.32 61.85,42.07 S1.3 S1.4 61.85,49.59 62.74,50.47 62.74,73.36 61.34,74.75 59.13,74.75 R29.1 | 52.88,77.72 40.06,77.72 v39.88,77.55 | v39.88,79.32 39.75,79.45 IC1.29 | IC1.29 | v52.86,77.47 52.88,77.47 52.88,77.72 | v52.83,82.19 52.81,82.17 49.71,82.17 49.12,82.75 49.12,83.29 47.59,84.82 JP1.5 | R29.1 58.67,74.33 | 52.88,77.72 57.48,77.72 58.37,76.83 58.37,74.63 R29.1
  Bottom 0.203: v39.88,77.55 v39.88,79.32 | v52.86,77.47 53.01,77.62 53.01,82.02 v52.83,82.19
RTS
  Top 0.203: 53.05,34.52 52.25,35.31 52.25,35.87 | IC2.3 60.27,32.28 60.27,33.09 59.24,34.12 59.08,34.28 53.29,34.28 53.05,34.52 | 53.05,34.52 | 52.25,35.87 52.25,35.91 | 52.25,35.87 R9.1
RX
  Top 0.152: 59.23,79.14 59.88,79.8 60.95,79.8 61.59,79.15
  Top 0.203: 40.26,81.03 IC1.30 40.25,79.89 41,79.14 59.23,79.14 | 60.83,37.49 60.96,37.62 | 60.96,37.62 63.2,39.85 63.2,77.55 61.59,79.15 | R10.1 61.02,37.62 60.96,37.62
RXD
  Top 0.203: IC2.1 61.54,32.28 61.54,33.48 61.09,33.94 R10.2
RXLED
  Top 0.203: IC2.23 58.31,23.86 58.57,23.6 58.9,23.6 59.23,23.27 60.51,23.27 L3.C
SCK  (via drill 0.3)
  Top 0.152: 50.98,86.41 50.98,88 50.95,88.03
  Top 0.203: v44.2,19.94 44.25,19.99 44.25,20.55 43.46,21.34 43.46,40.92 49.78,47.24 49.78,52.25 53.42,55.88 53.42,76.2 v53.49,76.2 | v36.83,88.88 36.75,88.88 36.27,88.39 36.27,87.78 36.8,87.25 36.8,86.51 37.15,86.17 IC1.17 | v40.18,91.9 40.18,91.67 40.23,91.67 40.82,91.08 41.79,91.08 42.22,90.66 42.22,90.17 43.89,88.49 50.48,88.49 50.95,88.03 | 50.85,84.82 JP1.3 | R3.2 43.56,9.63 42.72,10.46 42.72,13.79 46.41,17.48 46.63,17.48 v46.69,17.53 | v53.49,82.75 53.34,82.91 52.73,82.91 50.85,84.78 50.85,84.82 | 50.85,84.82 50.98,84.95 50.98,86.41
  Bottom 0.203: v53.49,76.2 v53.49,82.75 | v44.2,19.94 44.27,19.86 44.98,19.86 46.71,18.14 46.71,17.55 v46.69,17.53 | v36.83,88.88 37.19,89.23 37.8,89.23 40.18,91.62 v40.18,91.9
SCL
  Top 0.203: IC1.28 39.25,79.02 39.6,78.66 60.34,78.66 BRIDGE.4
SDA
  Top 0.203: IC1.27 38.75,78.86 39.41,78.21 58.39,78.21 BRIDGE.5
SLP_BTN  (via drill 0.3)
  Top 0.203: IC1.32 41.25,80.47 41.63,80.09 44.63,80.09 v44.78,80.24 | v44.91,76.96 45.21,77.27 50.9,77.27 52.93,75.24 52.93,56.11 49.3,52.48 49.3,47.45 42.98,41.12 42.98,21.36 35.69,14.07 35.69,11.46 25.44,1.21 10.68,1.21 10.68,1.51 10.85,1.68 | S2.1 10.12,2.41 10.85,1.68 | 10.85,1.68 10.99,1.68 C1.1
  Bottom 0.203: v44.91,76.96 44.91,77.06 44.58,77.39 44.58,80.03 v44.78,80.24
TX
  Top 0.152: 59.14,79.61 59.17,79.61 59.74,80.19 61.29,80.19
  Top 0.203: R11.1 62.59,37.65 62.34,37.9 63.63,39.19 63.63,77.85 61.29,80.19 | IC1.31 40.75,80.2 41.33,79.61 59.14,79.61
TXD  (via drill 0.3)
  Top 0.203: IC2.5 58.96,30.79 v58.75,30.58 | v60.4,30.58 61.97,30.58 62.49,31.1 62.49,35.83 62.52,35.85 R11.2
  Bottom 0.203: v58.75,30.58 v60.4,30.58
TXLED
  Top 0.203: IC2.22 57.66,22.94 L4.C
VBAT
  Top 0.305: 44.48,3.45 44.22,3.45
  Top 1.676: 44.48,3.45 S3.P$1
  Top 2.184: B1.PLUS 58.4,54.51 56.19,54.51 52.93,51.26 52.93,45.8 46.58,39.45 46.58,19.76 41.22,14.4 41.22,6.45 44.22,3.45
VCC  (via drill 0.3, 0.6, 0.9)
  Top 0.203: R28.1 52.39,90.64 52.4,90.65
  Top 0.254: 9.63,79.95 R13.1 | 9.63,79.95 C10.1 10.02,79.95 11.33,81.25 11.33,81.53 11.35,81.56 11.35,81.65 R15.1 | v13.18,79.45 12.83,79.81 9.63,79.81 9.63,79.95
  Top 0.305: IC1.4 42.53,83.14 C19.1 | IC1.6 42.83,84.14 C19.1 | IC1.18 35.32,84.64 C16.1 34.09,85.83 32.05,85.83 32,85.88 | 32,85.88 R22.2 | 32,85.88 32,85.85 32.03,85.83 22.1,85.83 v20.55,84.28 | 18.82,69.62 18.82,69.07 C24.+ | 18.33,68.72 18.63,69.02 C24.+ | 18.33,68.72 17.22,67.61 4.52,67.61 C8.1 3.58,67.64 PQ1.K | R21.1 C14.1 21.19,71.99 18.82,69.62 | C24.+ 18.78,69.46 17.75,70.48 v17.75,78.99 | 18.33,68.72 18.33,69.15 16.2,71.27 16.2,76.4 v14.61,78 | C24.+ 18.9,68.91 18.9,68.3 19.58,67.61 24.92,67.61 28.98,63.55 35.9,63.55 46.18,53.27 46.18,48.41 39.98,42.22 39.98,22.54 34.54,17.09 24.74,17.09 D1.2 16.73,12.71 R1.1 C2.1 | 18.82,69.62 18.82,71.02 19.41,71.6 v19.41,78.99 | C19.1 43.19,83.48 43.81,82.86 44.76,82.86 45.55,82.06 45.94,82.06 47.37,80.62 55.63,80.62 v55.75,80.75 | R29.2 58.32,72.13 58.32,69.81 C23.+ 55.75,69.73 v55.75,77.09 | IC3.1 46.59,13.66 C4.1 47.36,13.68 47.55,13.49 47.55,11.96 48.54,10.97 | IC3.3 46.4,8.58 C3.1 47.23,8.4 47.55,8.71 47.55,9.98 48.54,10.97 | C22.+ 48.69,10.82 48.54,10.97 | C22.+ | C11.1 PQ2.K 17.75,85.78 v17.75,82.7 | C11.1 16.92,88.39 16.94,88.42 16.94,88.18 C11.1
  Top 0.406: 54.63,88.34 54.63,87.76 v54.25,87.38
  Top 1.016: v33.5,98.25 16.65,98.25 C12.1 15.21,98.23 R18.2 | v53.09,95.53 53.09,94.87 52.4,94.18 52.39,94.17 | 52.39,94.17 52.27,94.06 51.79,94.06 Q3.2 52.39,94.17
  Top 1.422: C24.+ 18.79,69.01 21.34,69.01 28.84,76.52 35.4,76.52 42.6,69.32 v50.09,69.32 | v57.02,76.66 57.02,68.86 56.99,68.83 | v57.02,82.63 56.97,82.63 54.63,84.96 54.63,88.34 52.4,90.58 52.4,90.65 52.4,94.18
  Top 1.676: 48.97,13.46 48.97,13.34 48.84,13.21 48.84,11.15 C22.+
  Top 1.93: 49.1,13.34 48.97,13.46
  Top 2.184: 56.99,68.83 C23.+ 56.99,62.01 61.04,57.96 61.04,53.21 59.59,51.77 57,51.77 55.47,50.24 55.47,44.68 49.1,38.3 49.1,13.34 49.1,11.89
  Bottom 0.254: 14.61,78.03 v13.18,79.45
  Bottom 0.305: v14.61,78 14.61,78.03 | C23.+ 56.28,69.85 | v55.75,77.09 v55.75,80.75 | v20.55,84.28 19.41,83.13 v19.41,78.99 | v17.75,78.99 v17.75,82.7
  Bottom 0.406: JP1.2 54.24,87.36 v54.25,87.38
  Bottom 1.016: v33.5,98.25 51.54,98.25 53.09,96.7 v53.09,95.53
  Bottom 1.422: v57.02,76.66 v57.02,82.63 | v50.09,69.32 50.07,69.3 56.18,69.3 C23.+
  Bottom 1.676: S3.P$2 42.48,2.96 43.64,4.12 45.77,4.12 48.69,7.04 C22.+ | C22.+
VSW
  Top 0.406: R24.2 41.66,98.07 41.55,98.17
  Top 1.016: 39.67,96.34 LCD.P$2 39.64,98.17 C17.1 39.74,98.17 41.55,98.17 50.75,98.17 | 50.75,98.17 59.87,98.17 62.69,95.35 62.69,86.36 C21.1 BRIDGE.1 | Q3.3 50.72,98.15 50.75,98.17
VSW_SW  (via drill 0.3)
  Top 0.203: IC1.7 45.66,84.64 45.8,84.51 45.8,84.12 47.47,82.45 v47.47,82.14 | v48.44,83.03 48.44,82.78 49.68,81.54 54.45,81.54 54.81,81.91 54.81,83.19 53.57,84.43 53.57,87.83 51.59,89.81 50.09,89.81 49.4,90.5 R27.2
  Bottom 0.203: v48.44,83.03 47.55,82.14 v47.47,82.14
VUSB  (via drill 0.41)
  Top 0.203: 61.64,3.35 61.72,3.35 61.72,3.14 | UBT1.1 61.67,3.25 61.67,3.38 | UBT1.2 61.65,4.82
  Top 0.406: IC2.20 IC2.19 | IC2.20 56.09,25.02 56.06,24.99 56.06,22.45 | IC2.4 59.61,29.79 56.36,26.54 IC2.20 | C6.1 56,22.52 56.06,22.45 | 61.76,3.12 61.72,3.14 61.47,3.28 51.31,3.28 51.28,3.38 D2.1 | 61.64,3.35 61.67,3.38 61.8,3.5 62.57,3.5 63.02,3.95 63.02,18.36 62.56,18.82 | 62.56,18.82 59.66,18.82 | 59.66,18.82 57.17,18.82 56.8,19.2 56.8,21.74 56.09,22.45 56.06,22.45 | 62.56,18.82 62.56,20.55 62.59,20.57 62.67,20.57 R8.1 | 59.66,18.82 R7.1 | 61.65,4.82 v61.65,6.12 | UBT1.1 UBT1.2
  Bottom 0.406: USB.VBUS 58.2,5.72 58.6,6.12 v61.65,6.12

### Text on the board
tPlace: LASER | ISP | . | + | + | + | RST | - | . | NoMi | D E S I G N | TXD | RXD | 0v39 | GO | AUX | OFF/ON | USB | CAM
bPlace: IR LED | LASER | + | + | . | D E S I G N | NoMi